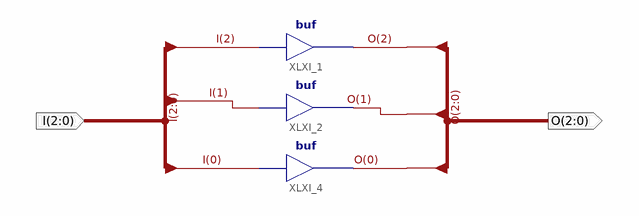
[diagram p0: schematic sheet 1]
// Xilinx ISE schematic In_Out_Connector.sch (spartan3e) as structural Verilog: 3 symbols, 2 ports
module In_Out_Connector (
  input  [2:0] I,
  output [2:0] O
);

  buf XLXI_1 (O[2], I[2]);
  buf XLXI_2 (O[1], I[1]);
  buf XLXI_4 (O[0], I[0]);
endmodule
